# EAGLE design OMS_cup_wash_sucction (EAGLE 8.5.1)

## Sheet 1 of 3
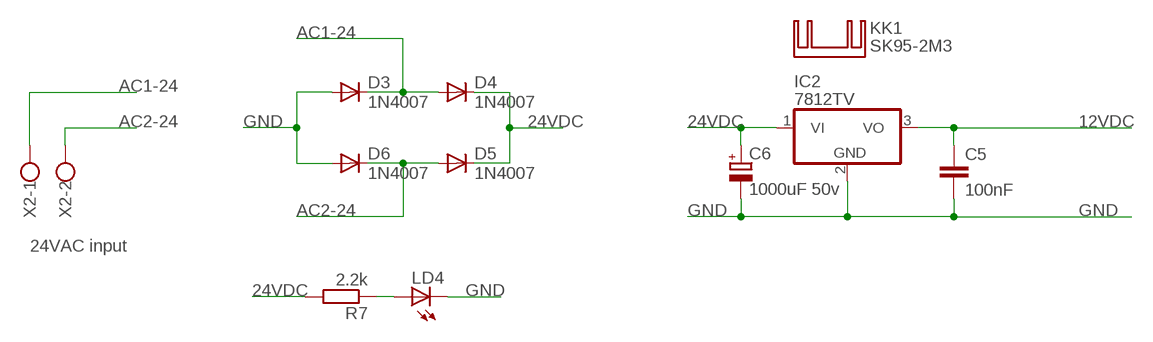
[diagram p0: schematic, sheet 1]

### Parts
C5  100nF  C-EU050-025X075  [C050-025X075]
C6  1000uF 50v  CPOL-EUE5-13  [E5-13]
D3  1N4007  1N4004  [DO41-10]
D4  1N4007  1N4004  [DO41-10]
D5  1N4007  1N4004  [DO41-10]
D6  1N4007  1N4004  [DO41-10]
IC2  7812TV  [TO220V]
KK1  SK95-2M3  [SK95-2M3]
LD4  LED5MM  [LED5MM]
R7  2.2k  R-EU_0207/10  [0207/10]
X2  W237-102  [W237-102]

### Nets
12VDC: C5.1 IC2.3(VO) ; also sheet 2
24VDC: C6.+ D4.C D5.C IC2.1(VI) R7.2 ; also sheet 2,3
AC1-24: D3.C D4.A X2.1 ; also sheet 2,3
AC2-24: D5.A D6.C X2.2 ; also sheet 2,3
GND: C5.2 C6.- D3.A D6.A IC2.2(GND) LD4.K(C) ; also sheet 2,3
N$8: LD4.A R7.1

### Notes on the sheet
- 24VAC input

## Sheet 2 of 3
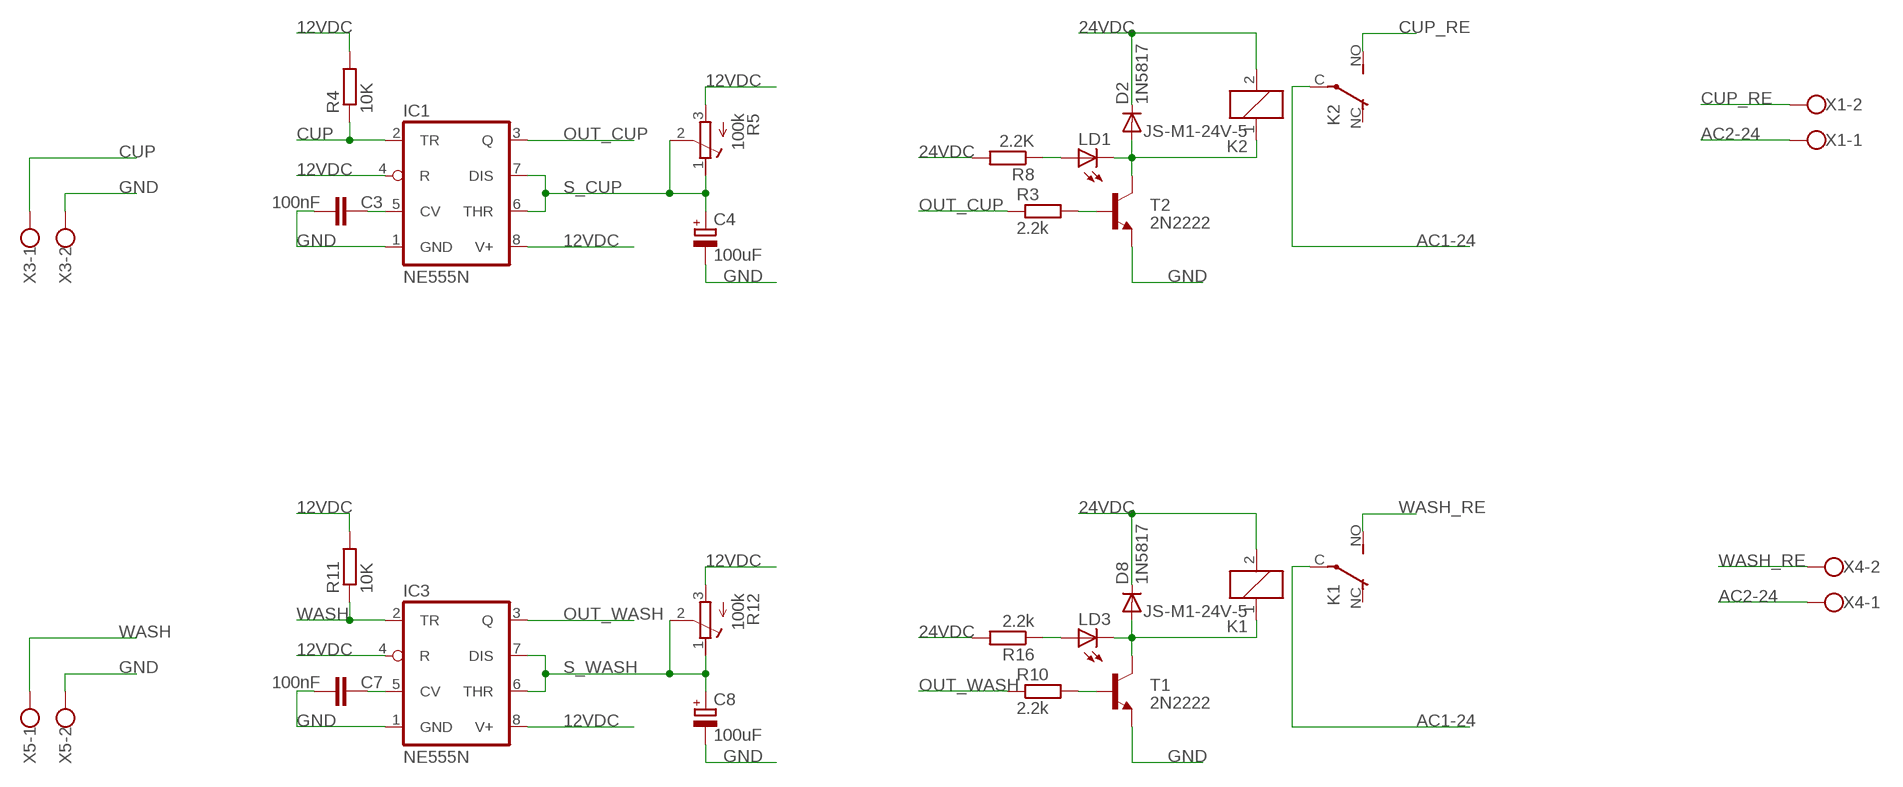
[diagram p1: schematic, sheet 2]

### Parts
C3  100nF  C-EU050-025X075  [C050-025X075]
C4  100uF  CPOL-EUE3.5-8  [E3,5-8]
C7  100nF  C-EU050-025X075  [C050-025X075]
C8  100uF  CPOL-EUE3.5-8  [E3,5-8]
D2  1N5817  1N4004  [DO41-10]
D8  1N5817  1N4004  [DO41-10]
IC1  NE555N  [DIL08-ROUND]
IC3  NE555N  [DIL08-ROUND]
K1  JS-M1-24V-5  JS-M1-12V-5  [JS-M]
K2  JS-M1-24V-5  JS-M1-12V-5  [JS-M]
LD1  LED5MM  [LED5MM]
LD3  LED5MM  [LED5MM]
R3  2.2k  R-EU_0207/10  [0207/10]
R4  10K  R-EU_0207/10  [0207/10]
R5  100k  R-TRIMMT93XA  [RTRIMT93XA]
R8  2.2K  R-EU_0207/10  [0207/10]
R10  2.2k  R-EU_0207/10  [0207/10]
R11  10K  R-EU_0207/10  [0207/10]
R12  100k  R-TRIMMT93XA  [RTRIMT93XA]
R16  2.2k  R-EU_0207/10  [0207/10]
T1  2N2222  [TO92-EBC-OVAL]
T2  2N2222  [TO92-EBC-OVAL]
X1  W237-102  [W237-102]
X3  W237-102  [W237-102]
X4  W237-102  [W237-102]
X5  W237-102  [W237-102]

### Nets
12VDC: IC1.4(R) IC1.8(V+) IC3.4(R) IC3.8(V+) R4.2 R5.3(A) R11.2 R12.3(A) ; also sheet 1
24VDC: D2.C D8.C K1.2 K2.2 R8.2 R16.2 ; also sheet 1,3
AC1-24: K1.C(2:P) K2.C(2:P) ; also sheet 1,3
AC2-24: X1.1 X4.1 ; also sheet 1,3
CUP: IC1.2(TR) R4.1 X3.1
CUP_RE: K2.NO(2:S) X1.2
GND: C3.2 C4.- C7.2 C8.- IC1.1(GND) IC3.1(GND) T1.E T2.E X3.2 X5.2 ; also sheet 1,3
N$1: R3.2 T2.B
N$2: C3.1 IC1.5(CV)
N$3: D2.A K2.1 LD1.K(C) T2.C
N$5: C7.1 IC3.5(CV)
N$6: LD1.A R8.1
N$11: D8.A K1.1 LD3.K(C) T1.C
N$12: R10.2 T1.B
N$14: LD3.A R16.1
OUT_CUP: IC1.3(Q) R3.1
OUT_WASH: IC3.3(Q) R10.1
S_CUP: C4.+ IC1.6(THR) IC1.7(DIS) R5.1(E) R5.2(S)
S_WASH: C8.+ IC3.6(THR) IC3.7(DIS) R12.1(E) R12.2(S)
WASH: IC3.2(TR) R11.1 X5.1
WASH_RE: K1.NO(2:S) X4.2
Unconnected: K1.NC(2:O) K2.NC(2:O)

## Sheet 3 of 3
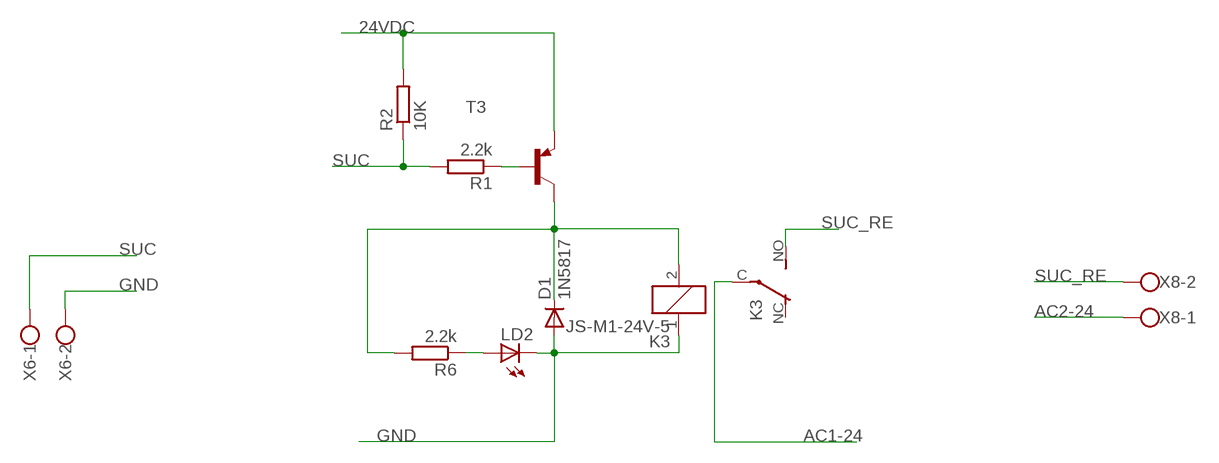
[diagram p2: schematic, sheet 3]

### Parts
D1  1N5817  1N4004  [DO41-10]
K3  JS-M1-24V-5  JS-M1-12V-5  [JS-M]
LD2  LED5MM  [LED5MM]
R1  2.2k  R-EU_0207/10  [0207/10]
R2  10K  R-EU_0207/10  [0207/10]
R6  2.2k  R-EU_0207/10  [0207/10]
T3  2N5401-PNP-TO92-EBC  [TO92-EBC]
X6  W237-102  [W237-102]
X8  W237-102  [W237-102]

### Nets
24VDC: R2.2 T3.E ; also sheet 1,2
AC1-24: K3.C(2:P) ; also sheet 1,2
AC2-24: X8.1 ; also sheet 1,2
GND: D1.A K3.1 LD2.K(C) X6.2 ; also sheet 1,2
N$7: R1.1 T3.B
N$9: LD2.A R6.1
NS1: D1.C K3.2 R6.2 T3.C
SUC: R1.2 R2.1 X6.1
SUC_RE: K3.NO(2:S) X8.2
Unconnected: K3.NC(2:O)

## Library data of the parts
C3 C5 C7 = rcl:C-EU: CAPACITOR, European symbol; SPICEPREFIX: C
C4 C6 C8 = rcl:CPOL-EU: POLARIZED CAPACITOR, European symbol; SPICEPREFIX: C
D1-D6 D8 = adafruit:1N4004: DIODE General purpose 1N400x type rectifier (With bigger pads) http://www.ladyada.net/library/pcb/eaglelibrary.html
IC1 IC3 = adafruit:*555: TIMER Changed DIP package to have round (not oval) pin pads http://www.ladyada.net/library/pcb/eaglelibrary.html
IC2 = linear:78*: Positive VOLTAGE REGULATOR Source: http://cache.national.com/ds/LM/LM78L05.pdf http://www.fairchildsemi.com/ds/LM/LM7805.pdf
K1-K3 = relay:JS-M1*: Automotive Ultra-Miniature Power Relay NAiS Source: http://www.mew-europe.com/.. en_ds_61211_0000.pdf; MF: FARNELL; MPN: JSM1-12V-5; OC_FARNELL: 910351; OC_NEWARK: 14J1764
KK1 = heatsink:SK95-2M3: HEATSINK manufacturer Fischer/distributor Buerklin
LD1-LD4 = led:LED: LED OSRAM: - CHIPLED LG R971, LG N971, LY N971, LG Q971, LY Q971, LO R971, LY R971 LH N974, LH R974 LS Q976, LO Q976, LY Q976 LO Q996 - Hyper CHIPLED LW Q18S LB Q993, LB Q99A, LB R99A - SideLED LS A670, LO A670, LY A670, LG A670, LP A670 LB A673, LV A673, LT A673, LW A673 LH A674 LY A675 LS A676, LA A676, LO A676, LY A676, LW A676 LS A679, LY A679, LG A679 - Hyper Micro SIDELED® LS Y876, LA Y876, LO Y876, LY Y876 LT Y87S - SmartLED LW L88C, LW L88S LB L89C, LB L89S, LG L890 LS L89K, LO L89K, LY L89K LS L896, LA L896, LO L896, LY L896 - TOPLED LS T670, LO T670, LY T670, LG T670, LP T670 LSG T670, LSP T670, LSY T670, LOP T670, LYG T670 LG T671, LOG T671, LSG T671 LB T673, LV T673, LT T673, LW T673 LH T674 LS T676, LA T676, LO T676, LY T676, LB T676, LH T676, LSB T676, LW T676 LB T67C, LV T67C, LT T67C, LS T67K, LO T67K, LY T67K, LW E67C LS E67B, LA E67B, LO E67B, LY E67B, LB E67C, LV E67C, LT E67C LW T67C LS T679, LY T679, LG T679 LS T770, LO T770, LY T770, LG T770, LP T770 LB T773, LV T773, LT T773, LW T773 LH T774 LS E675, LA E675, LY E675, LS T675 LS T776, LA T776, LO T776, LY T776, LB T776 LHGB T686 LT T68C, LB T68C - Hyper Mini TOPLED® LB M676 - Mini TOPLED Santana® LG M470 LS M47K, LO M47K, LY M47K Source: http://www.osram.convergy.de/
R1-R4 R6-R8 R10 R11 R16 = rcl-2:R-EU_: RESISTOR, European symbol
R5 R12 = rcl:R-TRIMM: Trimm resistor; SPICEMODEL: X; SPICEPREFIXL: POT
T1 T2 = adafruit:2N2222: NPN TRANSISTOR Big oval pads
T3 = transistor-neu-to92:*-PNP-: PNP Transistror
X1-X6 X8 = con-wago-500:W237-102: WAGO SCREW CLAMP

## Board
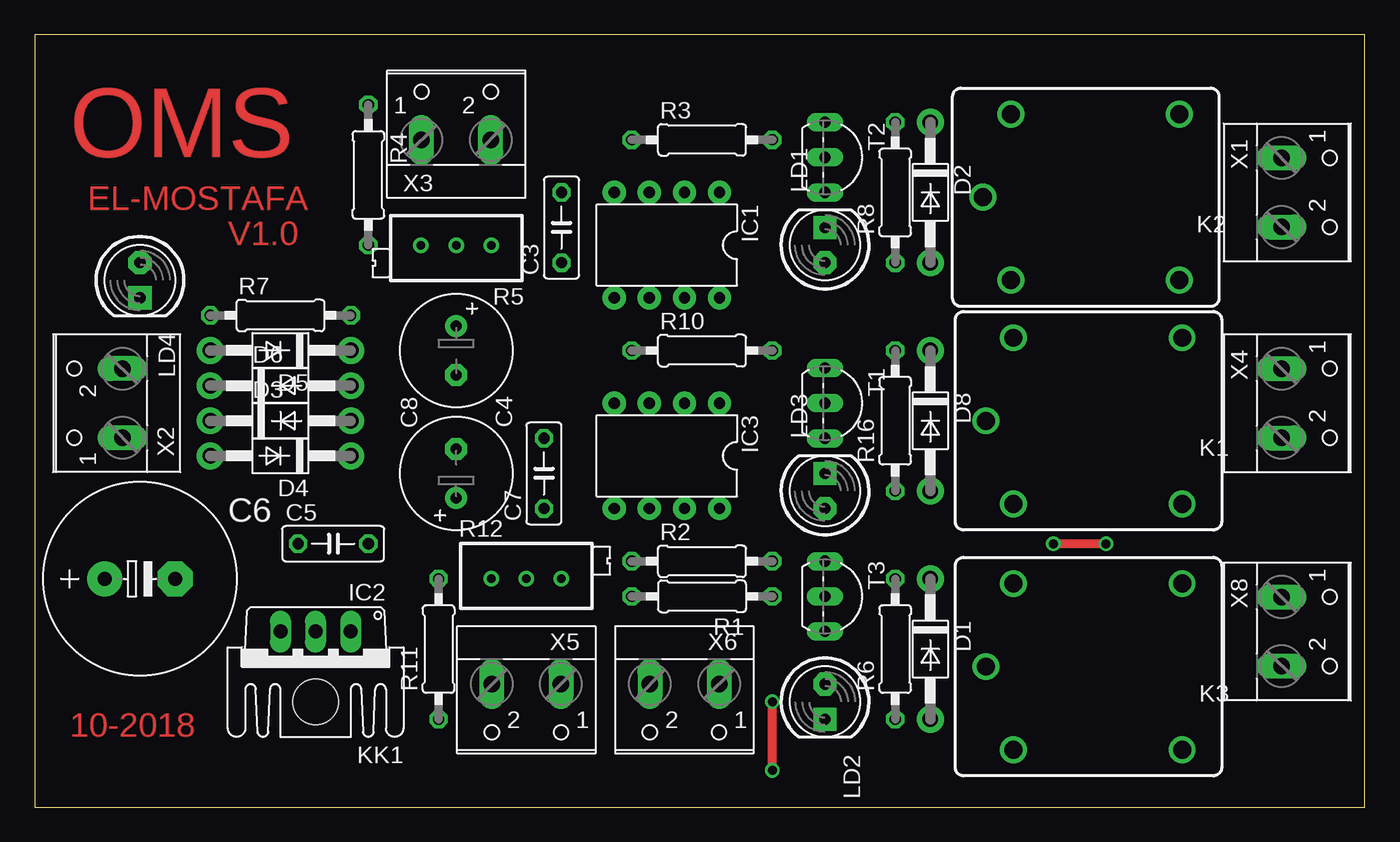
[diagram p3: board, top side]
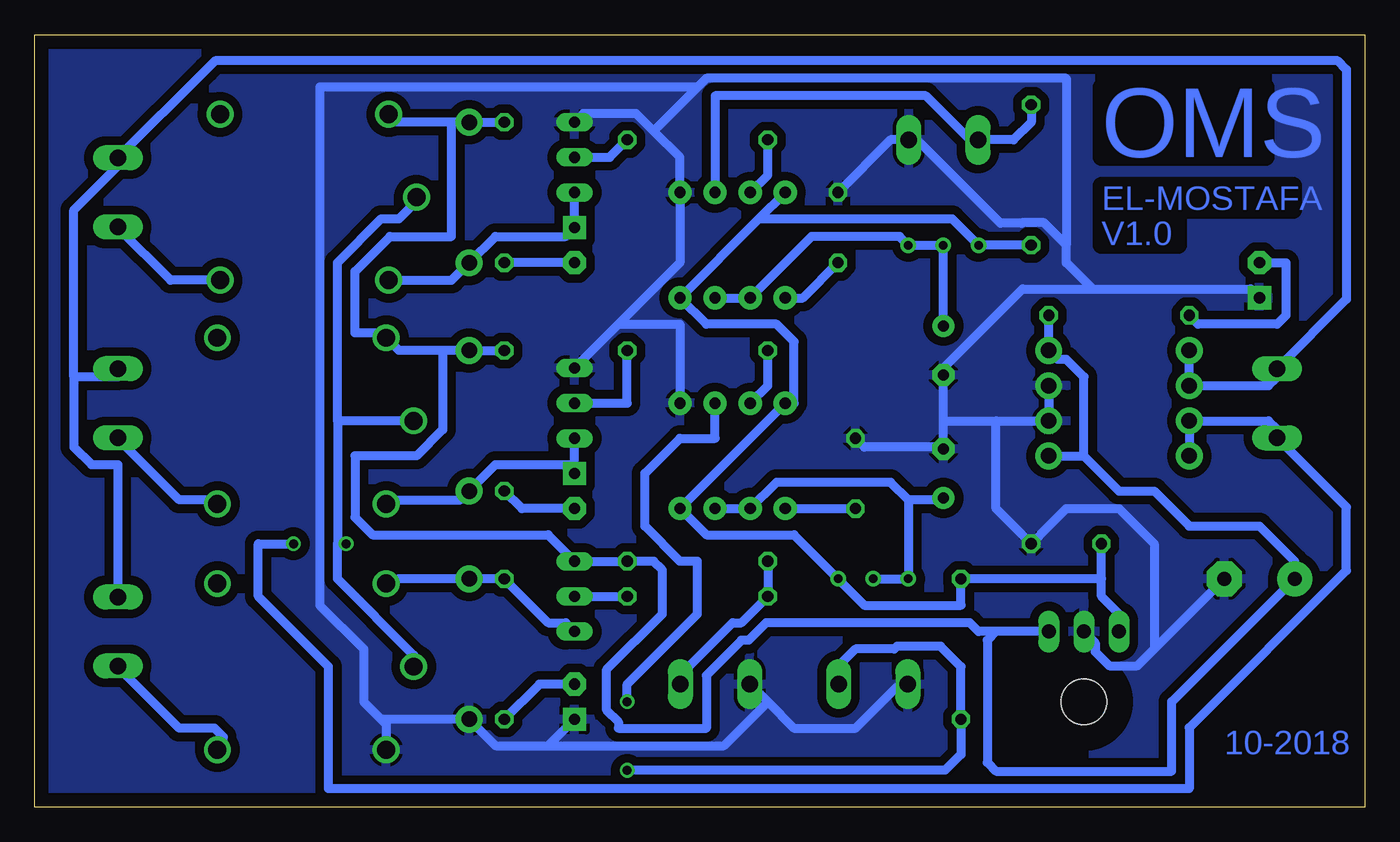
[diagram p4: board, bottom side, seen from below]

Size 96.19 x 55.87 mm. Coordinates in mm from the lower left corner, seen from the top.
Outline: 0,0 96.19,0 96.19,55.87 0,55.87 0,0
Copper layers (1*16): Top 0.035mm / dielectric 1.5mm / Bottom 0.035mm
Design rules "default *": minimum track width 25mil, minimum drill 0.35mm, track to track 25mil, track to pad 25mil, pad to pad 6mil, via to via 6mil, smd to smd 6mil, copper to edge 40mil, drill to drill 6mil, minimum pad ring 10mil, minimum via ring 8mil, stop-mask expansion 4mil, vias tented up to drill 0mil, thermal gap 10mil

### Footprints (pad centres in the part's own frame; a part is rotated, then mirrored left to right if it is on the bottom)
C050-025X075 = drill 0.813 octagon: 1 -2.54,0; 2 2.54,0
E3,5-8 = drill 0.813 pad 1.6: + -1.778,0 | drill 0.813 pad 1.6 octagon: - 1.778,0
E5-13 = drill 1.016 pad 2.54: + -2.54,0 | drill 1.016 pad 2.54 octagon: - 2.54,0
DO41-10 = drill 1.118 pad 1.93: A 5.08,0; C -5.08,0
DIL08-ROUND = drill 0.813 pad 1.676: 1 -3.81,-3.81; 2 -1.27,-3.81; 3 1.27,-3.81; 4 3.81,-3.81; 5 3.81,3.81; 6 1.27,3.81; 7 -1.27,3.81; 8 -3.81,3.81
TO220V = drill 1.016 long: 1 -2.54,-2.54; 2 0,-2.54; 3 2.54,-2.54
JS-M = drill 1.3: 1 6.7,6; 2 6.7,-6; C 8.7,0; NC -5.5,-6; NO -5.5,6
SK95-2M3 = hole 3.302: 0,2.54
LED5MM = drill 0.813 pad 1.676 octagon: A -1.27,0 | drill 0.813 pad 1.676 square: K 1.27,0
0207/10 = drill 0.813 octagon: 1 -5.08,0; 2 5.08,0
RTRIMT93XA = drill 0.61: 1 0,-2.54; 2 0,0; 3 0,2.54
TO92-EBC-OVAL = drill 0.813 long: B 0,-1.27; C 2.54,-1.27; E -2.54,-1.27
TO92-EBC = drill 0.813 long: B 0,-1.27; C 2.54,-1.27; E -2.54,-1.27
W237-102 = drill 1.194 long: 1 -2.5,-1.27; 2 2.5,-1.27

### Placement (x,y rotation side)
C3  38.1,41.91 90 top
C4  30.48,33.02 270 top
C5  21.59,19.05 0 top
C6  7.62,16.51 0 top
C7  36.83,24.13 90 top
C8  30.48,24.13 90 top
D1  64.77,11.43 270 top
D2  64.77,44.45 270 top
D3  17.78,27.94 0 top
D4  17.78,25.4 180 top
D5  17.78,33.02 180 top
D6  17.78,30.48 0 top
D8  64.77,27.94 270 top
IC1  45.72,40.64 180 top
IC2  20.32,10.16 180 top
IC3  45.72,25.4 180 top
K1  77.47,27.94 180 top
K2  77.28,44.1 180 top
K3  77.47,10.16 180 top
KK1  20.32,10.16 180 top
LD1  57.15,40.64 90 top
LD2  57.15,7.62 270 top
LD3  57.15,22.86 90 top
LD4  7.62,38.1 270 top
R1  48.26,15.24 180 top
R2  48.26,17.78 0 top
R3  48.26,48.26 0 top
R4  24.13,45.72 270 top
R5  30.48,40.64 90 top
R6  62.23,11.43 90 top
R7  17.78,35.56 0 top
R8  62.23,44.45 90 top
R10  48.26,33.02 0 top
R11  29.21,11.43 90 top
R12  35.56,16.51 270 top
R16  62.23,27.94 90 top
T1  58.42,29.21 270 top
T2  58.42,46.99 270 top
T3  58.42,15.24 270 top
X1  91.44,44.45 270 top
X2  5.08,29.21 90 top
X3  30.48,49.53 0 top
X4  91.44,29.21 270 top
X5  35.56,7.62 180 top
X6  46.99,7.62 180 top
X8  91.44,12.7 270 top

### Tracks (layer width: path | path; a pad name or v marks a point on that pad's centre or on a via)
12VDC
  Bottom 0.635: IC1.4 43.81,42.55 | 43.81,42.55 IC1.8 47.62,34.92 42.54,34.92 41.27,33.66 41.27,29.21 IC3.4 IC3.8 47.62,19.68 41.27,19.68 R12.3 36.2,14.61 29.21,14.61 R11.2 19.05,16.51 | 43.81,42.55 29.84,42.55 R5.3 R4.2 | 19.05,16.51 19.05,15.24 17.78,13.97 IC2.3 | 19.05,16.51 C5.1
24VDC
  Bottom 0.635: R7.2 D5.C 22.23,32.38 21.59,32.38 20.32,31.11 20.32,25.4 | D4.C 20.32,25.4 | R8.2 D2.C 66.04,49.53 | 66.04,49.53 70.48,49.53 K2.2 | R16.2 D8.C 66.67,33.02 | 66.67,33.02 69.85,33.02 K1.2 71.12,34.29 73.03,34.29 73.03,38.73 70.48,41.27 66.04,41.27 66.04,49.53 | 66.67,33.02 66.67,27.3 68.58,25.4 73.03,25.4 73.03,20.95 71.76,19.68 59.05,19.68 T3.E R2.2 51.43,17.78 50.8,17.14 50.8,13.97 54.82,9.95 54.82,7.01 53.97,6.16 53.97,5.71 47.62,5.71 47.62,9.53 45.08,12.07 44.56,12.07 43.29,13.34 28.57,13.34 27.94,12.7 26.67,12.7 | 20.32,25.4 17.78,22.86 15.24,22.86 12.7,20.32 7.62,20.32 5.08,17.78 C6.+ 13.97,7.62 13.97,2.6 26.67,2.6 27.3,3.24 27.3,12.07 26.67,12.7 | IC2.1 26.67,12.7
AC1-24  (via drill 0.65)
  Top 0.635: v77.47,19.05 v73.66,19.05
  Bottom 0.635: D4.A D3.C 6.99,27.94 6.35,27.3 X2.1 1.33,21.69 1.33,17.11 12.7,5.75 12.7,1.33 53.34,1.33 53.89,1.33 68.52,1.33 68.58,1.33 74.93,1.33 74.93,10.16 80.01,15.24 80.01,19.05 v77.47,19.05 | 74.3,27.94 74.3,19.05 | 74.3,19.05 74.3,16.51 68.77,10.98 K3.C | K1.C 74.3,27.94 | 74.3,27.94 74.3,39.37 71.12,42.55 69.85,42.55 68.58,43.81 K2.C | v73.66,19.05 74.3,19.05
AC2-24
  Bottom 0.635: D5.A D6.C 6.99,30.48 6.35,31.11 X2.2 1.33,36.73 1.33,53.34 1.97,53.98 83.15,53.98 83.78,53.34 83.8,53.32 X1.1 90.17,46.35 93.34,43.18 93.34,31.11 | X8.1 90.17,24.77 92.08,24.77 93.34,26.04 93.34,31.11 | 93.34,31.11 90.17,31.11 X4.1
CUP
  Bottom 0.635: IC1.2 46.99,51.44 31.75,51.44 28.57,48.26 X3.1 25.4,48.26 24.13,49.53 R4.1
CUP_RE
  Bottom 0.635: K2.NO 86.36,38.1 90.17,41.91 X1.2
GND
  Bottom 0.635: 43.18,7.62 44.45,8.89 X6.2 | 43.18,7.62 41.27,5.71 36.83,5.71 33.65,8.89 X5.2 | 59.05,4.45 LD2.K | 59.05,4.45 62.87,4.45 D1.A 71.12,6.35 | 43.18,7.62 46.35,4.45 59.05,4.45 | 53.97,34.92 49.53,39.37 IC1.1 49.53,46.99 51.43,48.89 | 53.97,34.92 T1.E | T2.E 56.51,50.16 52.7,50.16 51.43,48.89 | IC3.1 49.53,34.92 53.97,34.92 | C3.2 34.29,48.26 X3.2 32.38,48.26 26.35,42.23 24.82,42.23 24.8,42.25 23.2,42.25 21.59,40.64 | D6.A D3.A 26.67,27.94 | C7.2 36.2,26.04 30.48,26.04 | 30.48,26.04 30.48,27.94 | 30.48,27.94 C4.- 30.48,31.75 24.77,37.46 19.68,37.46 | 30.48,26.04 C8.- | LD4.K 8.26,37.46 19.68,37.46 | 30.48,27.94 26.67,27.94 | 19.68,37.46 21.59,39.37 21.59,40.64 | 48.26,52.07 47.62,52.7 21.59,52.7 21.59,40.64 | 48.26,52.07 51.43,48.89 | 48.26,52.07 75.56,52.07 75.56,14.61 72.39,11.43 72.39,7.62 71.12,6.35 | 26.67,27.94 26.67,21.59 C5.2 22.86,20.32 22.23,20.95 21.59,21.59 17.78,21.59 15.24,19.05 15.24,11.43 | IC2.2 19.5,11.88 19.5,11.23 18.49,10.22 16.45,10.22 15.24,11.43 | 15.24,11.43 C6.- | 71.12,6.35 70.77,6 K3.1
  pour Bottom: 0,55.88 96.52,55.88 96.52,0 0,0
N$1
  Bottom 0.635: R3.2 54.61,46.99 T2.B
N$2
  Bottom 0.635: C3.1 40.64,36.83 IC1.5
N$3
  Bottom 0.635: T2.C LD1.K 57.78,41.27 62.87,41.27 D2.A 66.04,38.1 K2.1
N$5
  Bottom 0.635: IC3.5 C7.1
N$6
  Bottom 0.635: LD1.A R8.1
N$7
  Bottom 0.635: T3.B R1.1
N$8
  Bottom 0.635: R7.1 12.07,34.92 6.35,34.92 5.71,35.56 5.71,39.37 LD4.A
N$9
  Bottom 0.635: R6.1 59.69,8.89 LD2.A
N$11
  Bottom 0.635: 57.15,24.77 T1.C | K1.1 70.48,22.22 65.41,22.22 D8.A 62.87,24.77 57.15,24.77 | 57.15,24.77 LD3.K
N$12
  Bottom 0.635: R10.2 53.34,29.21 T1.B
N$14
  Bottom 0.635: R16.1 60.96,21.59 LD3.A
NS1
  Bottom 0.635: T3.C 57.78,13.34 59.05,13.34 R6.2 D1.C 69.85,16.51 K3.2
OUT_CUP
  Bottom 0.635: R3.1 43.18,45.72 IC1.3
OUT_WASH
  Bottom 0.635: R10.1 43.18,30.48 IC3.3
S_CUP
  Bottom 0.635: IC1.7 IC1.6 40,41.27 33.65,41.27 R5.1 R5.2 C4.+
S_WASH
  Bottom 0.635: IC3.7 IC3.6 42.54,23.49 34.29,23.49 33.02,22.22 | R12.2 R12.1 33.02,22.22 | 33.02,22.22 30.48,22.22 C8.+
SUC
  Bottom 0.635: R2.1 R1.2 45.08,13.34 45.72,13.34 48.89,10.16 48.89,8.89 X6.1
SUC_RE
  Bottom 0.635: X8.2 90.17,10.16 85.73,5.71 83.19,5.71 82.55,5.08 82.55,3.81 82.62,3.81 K3.NO
WASH  (via drill 0.65)
  Top 0.635: v53.34,2.66 v53.34,7.62
  Bottom 0.635: X5.1 38.06,10.2 36.83,11.43 34.03,11.43 33.82,11.63 30.68,11.63 29.21,10.16 R11.1 29.21,3.81 30.36,2.66 v53.34,2.66 | v53.34,7.62 53.34,8.89 48.26,13.97 48.26,17.78 49.53,17.78 52.07,20.32 52.07,24.13 49.53,26.67 46.99,26.67 IC3.2
WASH_RE
  Bottom 0.635: X4.2 90.17,26.67 85.73,22.22 83.19,22.22 K1.NO

### Text on the board
Top: OMS | EL-MOSTAFA | V1.0 | 10-2018
Bottom: OMS | EL-MOSTAFA | V1.0 | 10-2018